# Altium project Mach3.PrjPcb
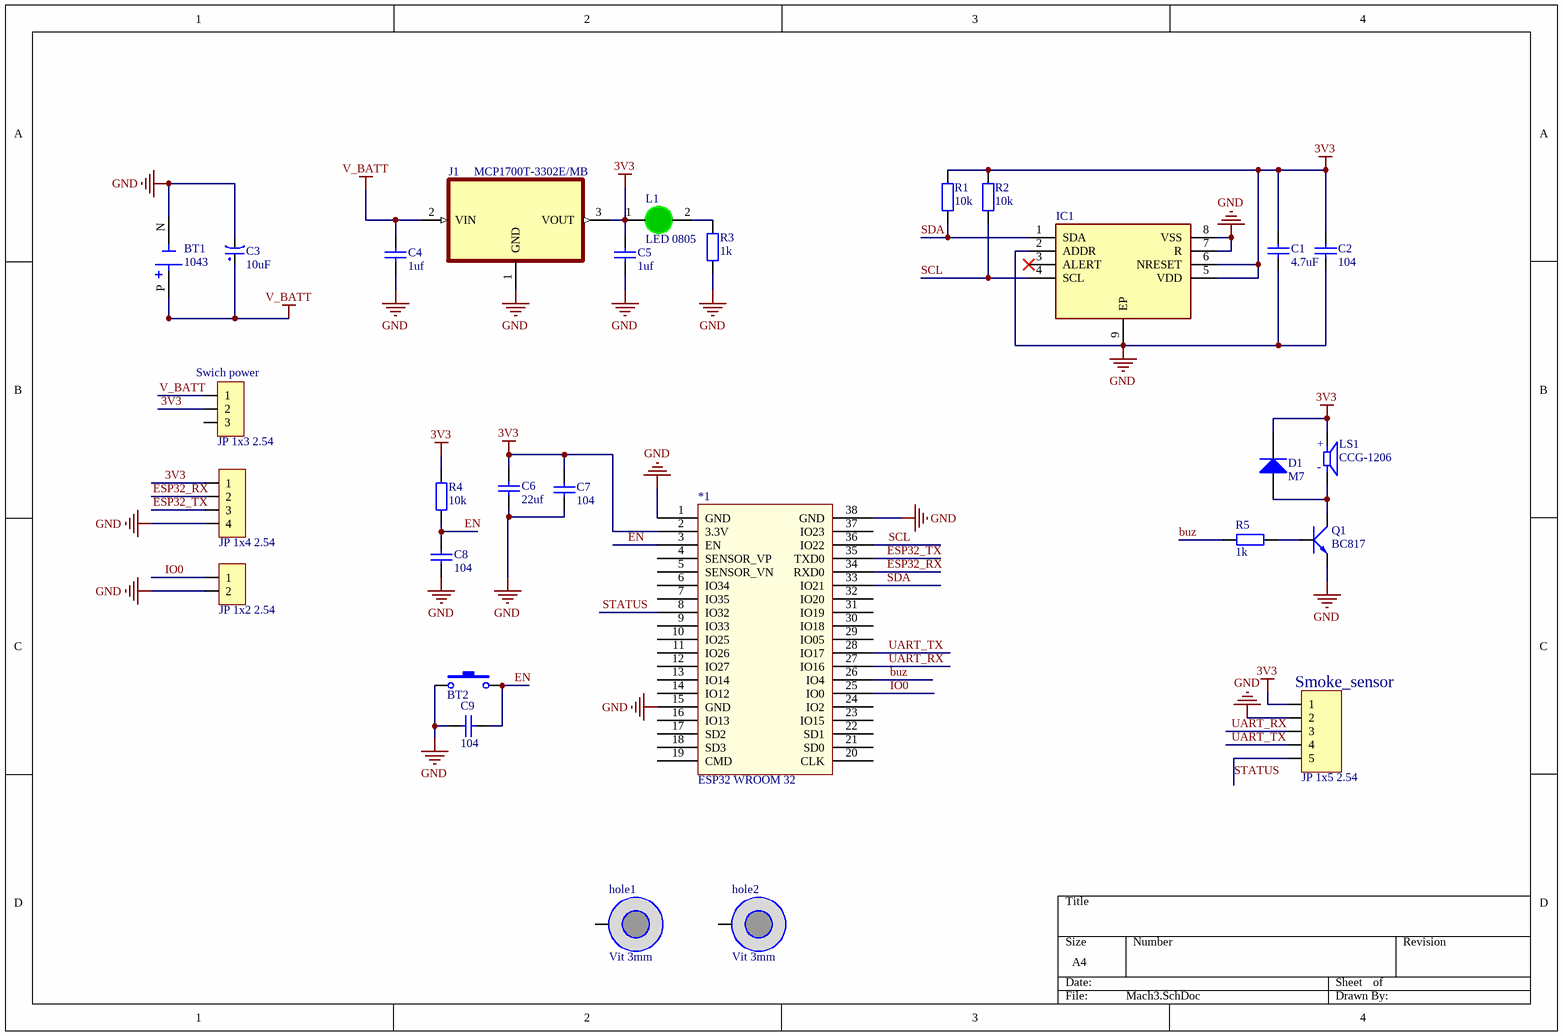
[diagram p0: Mach3.SchDoc]
1 sheet, 29 parts. Net scope: global (net labels, ports and power ports of the same name join across sheets).

## Sheet Mach3.SchDoc
size A4; Author: DucAnh; CompanyName: DucAnh; Organization: Linh Kien AGV; Address1: TrangBom-DongNai; Address2: no; Address3: no; Address4: no; Revision: 1.0Ver; SheetNumber: 1; SheetTotal: 1

### Parts
*1  ESP32 WROOM 32  [ESP32-WROOM-32D]
BT1  1043  [BAT_1043]
BT2  Nut Nhan 2 Chan SMD 3x6x2.5  [Nut Nhan 2 Chan SMD 3x6x2.5]  (value not drawn)
C1  4.7uF  [tu 0805]
C2  104  [tu 0805]
C3  10uF  [tu hoa 8mm]
C4  1uf  [tu 0805]
C5  1uf  [tu 0805]
C6  22uf  [tu 0805]
C7  104  [tu 0805]
C8  104  [tu 0805]
C9  104  [tu 0805]
D1  M7  [DIODE SMA]
hole1  Vit 3mm  [Screw 3.0]
hole2  Vit 3mm  [Screw 3.0]
IC1  (no value)  [SON50P250X250X100-9N-D]
J1  MCP1700T-3302E/MB  [MCP1700T-3302E/MB]
JP1  JP 1x5 2.54  [JP 1x5 CT]
JP2  JP 1x4 2.54  [JP 1x4 CT]
JP3  JP 1x2 2.54  [JP 1x2 DT]
JP4  JP 1x3 2.54  [JP 1x3 DT]
L1  LED 0805  [LED-1206-Green]
LS1  CCG-1206  [CUI_CCG-1206]
Q1  BC817  [SOT-23]
R1  10k  [tro smd 0805]
R2  10k  [tro smd 0805]
R3  1k  [tro smd 0805]
R4  10k  [tro smd 0805]
R5  1k  [tro smd 0805]

### Nets
3V3: *1.2(3.3V) C1.1 C2.1 C5.1 C6.1 C7.1 D1.2(K) IC1.5(VDD) IC1.6(NRESET) J1.3(VOUT) JP1.1 JP2.1 JP4.2 L1.1(A) LS1.P R1.2 R2.2 R4.2
GND: *1.1(GND) *1.15(GND) *1.38(GND) BT1.N(NEG) BT2.1 C1.2 C2.2 C3.2 C4.2 C5.2 C6.2 C7.2 C8.2 C9.1 IC1.2(ADDR) IC1.7(R) IC1.8(VSS) IC1.9(EP) J1.1(GND) JP1.2 JP2.4 JP3.2 Q1.2(E) R3.1
V_BATT: BT1.P(POS) C3.1 C4.1 J1.2(VIN) JP4.1
buz: *1.26(IO4) R5.2
EN: *1.3(EN) BT2.2 C8.1 C9.2 R4.1
ESP32_RX: *1.34(RXD0) JP2.2
ESP32_TX: *1.35(TXD0) JP2.3
IO0: *1.25(IO0) JP3.1
SCL: *1.36(IO22) IC1.4(SCL) R2.1
SDA: *1.33(IO21) IC1.1(SDA) R1.1
STATUS: *1.8(IO32) JP1.5
UART_RX: *1.27(IO16) JP1.3
UART_TX: *1.28(IO17) JP1.4
NetD1_1: D1.1(A) LS1.M Q1.3(C)
NetL1_2: L1.2(K) R3.2
NetQ1_1: Q1.1(B) R5.1

Not connected (* = marked no-connect by the designer): *1 4(SENSOR_VP) 5(SENSOR_VN) 6(IO34) 7(IO35) 9(IO33) 10(IO25) 11(IO26) 12(IO27) 13(IO14) 14(IO12) 16(IO13) 17(SD2) 18(SD3) 19(CMD) 20(CLK) 21(SD0) 22(SD1) 23(IO15) 24(IO2) 29(IO05) 30(IO18) 31(IO19) 32(IO20) 37(IO23); hole1 1(hole); hole2 1(hole); IC1 3(ALERT)*; JP4 3

### Notes on the sheet
- (near JP4) Swich power
- (near JP1) Smoke_sensor
- Title
- Size:
- Date:
- Author:
- A4
- Time:
- Number:
- Checked:
- Revision:
- Sheet
- Approved:
- of
- File:
- (in symbol CCG-1206) +; -

### Library data of the parts
BT1 = 1043: THM Holder for 18650 Battery; MF: Keystone Electronics; SnapEDA_Link: https://www.snapeda.com/parts/1043/Keystone/view-part/?ref=snap; Package: NON STANDARD-5 Keystone; Value: *; MP: 1043; Check_prices: https://www.snapeda.com/parts/1043/Keystone/view-part/?ref=eda
BT2 = Nut Nhan 2 Chan SMD 3x6x2.5: Ma_Hang: MH001036; Ten: Nút Nhấn 2 Chân 3x6x2.5MM SMD
C1 C2 C4-C9 = Tu 0805 104 50V 10%: Dán; Don_Vi: Con; So_Chan: 2; Ten_Linh_Kien: Tụ 0805 104-100nF 10% 50V; Ma_Hang: MH004551; Chung_Loai: Dán; Kieu_Chan: *
C3 = Tu Hoa 0.1uF 50V 5x11: Cắm; Don_Vi: Con; So_Chan: 2; Ten_Linh_Kien: Tụ Hóa 0.1uF 50V; Ma_Hang: MH006853; Chung_Loai: Cắm; Kieu_Chan: *
D1 = Diode M7 ( 4007 ): Dán; Don_Vi: Con; Ten_Linh_Kien: Diode M7 1N4007 SMD 1A 1000V; Ma_Hang: MH000944; Chung_Loai: Dán; Ghi_Chu: *
IC1 = SHT30-DIS-B10KS_1: Integrated Circuit; Manufacturer_Name: Sensirion; Datasheet Link: https://datasheet.lcsc.com/lcsc/2106070104_Sensirion-SHT30-DIS-B10KS_C2687423.pdf; Height: 1mm; Manufacturer_Part_Number: SHT30-DIS-B10KS; Mouser Part Number: 403-SHT30-DIS-B10KS; Mouser Price/Stock: https://www.mouser.co.uk/ProductDetail/Sensirion/SHT30-DIS-B10kS?qs=MLItCLRbWsxrR5sxpa2%2FcQ%3D%3D; Arrow Part Number: SHT30-DIS-B10KS; Arrow Price/Stock: https://www.arrow.com/en/products/sht30-dis-b10ks/sensirion-ag?utm_currency=USD&region=nac
J1 = MCP1700T-3302E/MB: Linear Voltage Regulator IC Positive Fixed 1 Output 250mA SOT-89-3; MF: Microchip; Value: *; Check_prices: https://www.snapeda.com/parts/MCP1700T-3302E/MB/Microchip/view-part/?ref=eda; Purchase-URL: https://pricing.snapeda.com/search/part/MCP1700T-3302E/MB/?ref=eda; Price: None; MP: MCP1700T-3302E/MB; Availability: In Stock; SnapEDA_Link: https://www.snapeda.com/parts/MCP1700T-3302E/MB/Microchip/view-part/?ref=snap; Package: SOT-89 Microchip
JP1 = JP 1x5 2.54 Cai Thang: Cắm; Ten_Linh_Kien: Jump Đơn Cái 2.54MM 1x20P Thẳng; Don_Vi: Con; Ma_Hang: MH004006; Ghi_Chu: *; Kieu_Chan: *; Chung_Loai: Cắm
JP2 = JP 1x4 2.54 Cai Thang: Cắm; Ten_Linh_Kien: Jump Đơn Cái 2.54MM 1x20P Thẳng; Don_Vi: Con; Ma_Hang: MH004006; Ghi_Chu: *; Kieu_Chan: *; Chung_Loai: Cắm
JP3 = JP 1x2 2.54 Duc Thang: Cắm; Ten_Linh_Kien: Jump Đơn Đực 2.54MM 1x40P Thẳng 11MM; Don_Vi: Con; Ma_Hang: MH000903; Ghi_Chu: *; Kieu_Chan: *; Chung_Loai: Cắm
JP4 = JP 1x3 2.54 Duc Thang: Cắm; Ten_Linh_Kien: Jump Đơn Đực 2.54MM 1x40P Thẳng 11MM; Don_Vi: Con; Ma_Hang: MH000903; Ghi_Chu: *; Kieu_Chan: *; Chung_Loai: Cắm
L1 = LED 1206 Xanh La: Dán; Don_Vi: Con; Ma_Hang: MH002947; Ten_Linh_Kien: LED1206 Màu Xanh Lá (Green); Ghi_Chu: *; Kieu_Chan: *; Chung_Loai: Dán
LS1 = CCG-1206: 12 mm, 5 V, 85 dB, Through Hole, Sealed, Magnetic Audio Transducer Buzzer; MF: Same Sky; SnapEDA_Link: https://www.snapeda.com/parts/CCG-1206/Same+Sky/view-part/?ref=snap; Package: None; Value: *; MP: CCG-1206; Check_prices: https://www.snapeda.com/parts/CCG-1206/Same+Sky/view-part/?ref=eda
Q1 = Trans BC817: SOT-23 - C8658; Value: C9014
R1-R5 = Tro 0805 1% 1k: Dán; Don_Vi: Con; So_Chan: 2; Ten_Linh_Kien: Trở 0805 1% 1k; Ma_Hang: MH005468; Chung_Loai: Dán; Kieu_Chan: *